# EAGLE design nRF_prog_vusb (EAGLE 6.4)
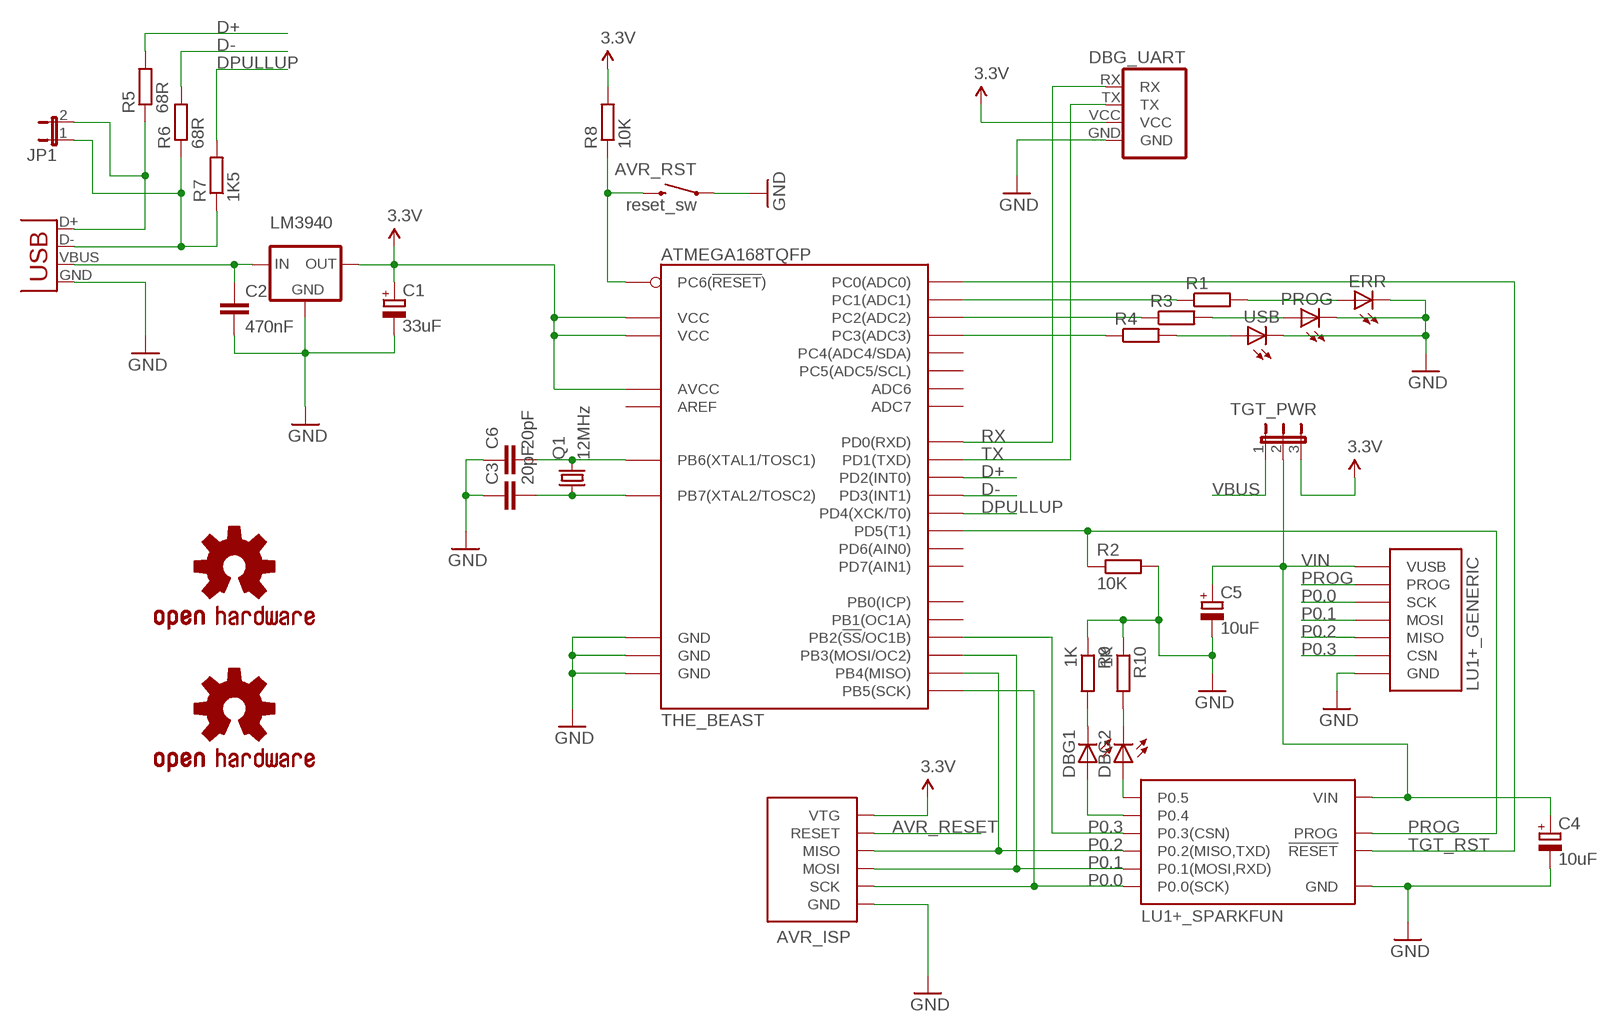
[diagram p0: schematic, sheet 1]

## Parts
AVR_ISP  AVR-ISP-6SMALL_FP  [AVR-ISP-6-SMALL-FP]
AVR_RST  reset_sw  SWITCH-MOMENTARY-2SMD  [TACTILE_SWITCH_SMD]
C1  33uF  CPOL-EUSMCB  [SMC_B]
C2  470nF  C-EUC0805K  [C0805K]
C3  20pF  C-EUC0805  [C0805]
C4  10uF  CPOL-EUSMCB  [SMC_B]
C5  10uF  CPOL-EUSMCB  [SMC_B]
C6  20pF  C-EUC0805  [C0805]
DBG1  LEDCHIPLED_0805  [CHIPLED_0805]
DBG2  LEDCHIPLED_0805  [CHIPLED_0805]
DBG_UART  UART_PORT  [UART_PORT]
ERR  LEDCHIPLED_0805  [CHIPLED_0805]
JP1  JP1E  [JP1]
LM3940  LM3940  [SOT223]
LU1+_GENERIC  NRF24LU1P_GENERIC  [NRF24LU1P_GENERIC]
LU1+_SPARKFUN  NRF24LU1P_SPARKFUN_BREAKOUT  [NRF24LU+_SPARKFUN_BREAKOUT]
PROG  LEDCHIPLED_0805  [CHIPLED_0805]
Q1  12MHz  CRYSTALHC49U-V  [QUARTZ]
R1  R-EU_M0805  [M0805]
R2  10K  R-EU_M0805  [M0805]
R3  R-EU_M0805  [M0805]
R4  R-EU_M0805  [M0805]
R5  68R  R-EU_M0805  [M0805]
R6  68R  R-EU_M0805  [M0805]
R7  1K5  R-EU_M0805  [M0805]
R8  10K  R-EU_M0805  [M0805]
R9  1K  R-EU_M0805  [M0805]
R10  1K  R-EU_M0805  [M0805]
TGT_PWR  JP2E  [JP2]
THE_BEAST  ATMEGA168TQFP  [TQFP32-08]
U$1  OSHW-LOGOM  [OSHW-LOGO-M]
U$2  OSHW-LOGOL  [OSHW-LOGO-L]
USB  LEDCHIPLED_0805  [CHIPLED_0805]
USB-B  USBPTH  [USB-B-PTH]

## Nets
3.3V: AVR_ISP.VCC(VTG) C1.+ DBG_UART.VCC LM3940.3(OUT) R8.2 TGT_PWR.3 THE_BEAST.4(VCC) THE_BEAST.6(VCC) THE_BEAST.18(AVCC)
AVR_RESET: AVR_ISP.RESET AVR_RST.3 R8.1 THE_BEAST.29(PC6(!RESET!))
D+: R5.2 THE_BEAST.32(PD2(INT0))
D-: R6.2 THE_BEAST.1(PD3(INT1))
DPULLUP: R7.2 THE_BEAST.2(PD4(XCK/T0))
GND: AVR_ISP.GND AVR_RST.1 C1.- C2.2 C3.1 C4.- C5.- C6.1 DBG_UART.GND ERR.C LM3940.2(GND) LM3940.4(GND) LU1+_GENERIC.GND LU1+_SPARKFUN.GND PROG.C R2.2 R9.1 R10.1 THE_BEAST.3(GND) THE_BEAST.5(GND) THE_BEAST.21(GND) USB-B.GND USB.C
N$1: DBG2.A LU1+_SPARKFUN.P0.5
N$2: DBG1.A LU1+_SPARKFUN.P0.4
N$3: DBG2.C R10.2
N$4: DBG1.C R9.2
N$8: R4.1 THE_BEAST.26(PC3(ADC3))
N$9: R3.1 THE_BEAST.25(PC2(ADC2))
N$13: R1.1 THE_BEAST.24(PC1(ADC1))
N$18: R4.2 USB.A
N$19: PROG.A R3.2
N$20: ERR.A R1.2
N$26: C6.2 Q1.2 THE_BEAST.7(PB6(XTAL1/TOSC1))
N$27: C3.2 Q1.1 THE_BEAST.8(PB7(XTAL2/TOSC2))
P0.0: AVR_ISP.SCK LU1+_GENERIC.SCK LU1+_SPARKFUN.P0.0(P0.0(SCK)) THE_BEAST.17(PB5(SCK))
P0.1: AVR_ISP.MOSI LU1+_GENERIC.MOSI LU1+_SPARKFUN.P0.1(P0.1(MOSI,RXD)) THE_BEAST.15(PB3(MOSI/OC2))
P0.2: AVR_ISP.MISO LU1+_GENERIC.MISO LU1+_SPARKFUN.P0.2(P0.2(MISO,TXD)) THE_BEAST.16(PB4(MISO))
P0.3: LU1+_GENERIC.CSN LU1+_SPARKFUN.P0.3(P0.3(CSN)) THE_BEAST.14(PB2(!SS!/OC1B))
PROG: LU1+_GENERIC.PROG LU1+_SPARKFUN.PROG R2.1 THE_BEAST.9(PD5(T1))
RX: DBG_UART.RX THE_BEAST.30(PD0(RXD))
TGT_RST: LU1+_SPARKFUN.RESET(!RESET!) THE_BEAST.23(PC0(ADC0))
TX: DBG_UART.TX THE_BEAST.31(PD1(TXD))
USB_D+: JP1.2 R5.1 USB-B.D+
USB_D-: JP1.1 R6.1 R7.1 USB-B.D-
VBUS: C2.1 LM3940.1(IN) TGT_PWR.1 USB-B.VBUS
VIN: C4.+ C5.+ LU1+_GENERIC.VUSB LU1+_SPARKFUN.VIN TGT_PWR.2
Unconnected: THE_BEAST.10(PD6(AIN0)) THE_BEAST.11(PD7(AIN1)) THE_BEAST.12(PB0(ICP)) THE_BEAST.13(PB1(OC1A)) THE_BEAST.19(ADC6) THE_BEAST.20(AREF) THE_BEAST.22(ADC7) THE_BEAST.27(PC4(ADC4/SDA)) THE_BEAST.28(PC5(ADC5/SCL))

## Library data of the parts
AVR_ISP = KileParts:AVR-ISP-6: AVR ISP-6 Serial Programming Header
AVR_RST = KileParts:SWITCH-MOMENTARY-2
C1 C4 C5 = rcl:CPOL-EU: POLARIZED CAPACITOR, European symbol
C2 C3 C6 = rcl:C-EU: CAPACITOR, European symbol
DBG1 DBG2 ERR PROG USB = led:LED: LED OSRAM: - CHIPLED LG R971, LG N971, LY N971, LG Q971, LY Q971, LO R971, LY R971 LH N974, LH R974 LS Q976, LO Q976, LY Q976 LO Q996 - Hyper CHIPLED LW Q18S LB Q993, LB Q99A, LB R99A - SideLED LS A670, LO A670, LY A670, LG A670, LP A670 LB A673, LV A673, LT A673, LW A673 LH A674 LY A675 LS A676, LA A676, LO A676, LY A676, LW A676 LS A679, LY A679, LG A679 - Hyper Micro SIDELED® LS Y876, LA Y876, LO Y876, LY Y876 LT Y87S - SmartLED LW L88C, LW L88S LB L89C, LB L89S, LG L890 LS L89K, LO L89K, LY L89K LS L896, LA L896, LO L896, LY L896 - TOPLED LS T670, LO T670, LY T670, LG T670, LP T670 LSG T670, LSP T670, LSY T670, LOP T670, LYG T670 LG T671, LOG T671, LSG T671 LB T673, LV T673, LT T673, LW T673 LH T674 LS T676, LA T676, LO T676, LY T676, LB T676, LH T676, LSB T676, LW T676 LB T67C, LV T67C, LT T67C, LS T67K, LO T67K, LY T67K, LW E67C LS E67B, LA E67B, LO E67B, LY E67B, LB E67C, LV E67C, LT E67C LW T67C LS T679, LY T679, LG T679 LS T770, LO T770, LY T770, LG T770, LP T770 LB T773, LV T773, LT T773, LW T773 LH T774 LS E675, LA E675, LY E675, LS T675 LS T776, LA T776, LO T776, LY T776, LB T776 LHGB T686 LT T68C, LB T68C - Hyper Mini TOPLED® LB M676 - Mini TOPLED Santana® LG M470 LS M47K, LO M47K, LY M47K Source: http://www.osram.convergy.de LUXEON: - LUMILED® LXK2-PW12-R00, LXK2-PW12-S00, LXK2-PW14-U00, LXK2-PW14-V00 LXK2-PM12-R00, LXK2-PM12-S00, LXK2-PM14-U00 LXK2-PE12-Q00, LXK2-PE12-R00, LXK2-PE12-S00, LXK2-PE14-T00, LXK2-PE14-U00 LXK2-PB12-K00, LXK2-PB12-L00, LXK2-PB12-M00, LXK2-PB14-N00, LXK2-PB14-P00, LXK2-PB14-Q00 LXK2-PR12-L00, LXK2-PR12-M00, LXK2-PR14-Q00, LXK2-PR14-R00 LXK2-PD12-Q00, LXK2-PD12-R00, LXK2-PD12-S00 LXK2-PH12-R00, LXK2-PH12-S00 LXK2-PL12-P00, LXK2-PL12-Q00, LXK2-PL12-R00 Source: www.luxeon.com KINGBRIGHT: KA-3528ASYC Source: www.kingbright.com
DBG_UART = KileParts:UART_PORT: PIN HEADER; OC_FARNELL: unknown; OC_NEWARK: unknown
JP1 = KileParts:JP1E: JUMPER
LM3940 = KileParts:LM3940: Low drop (max 0.4V at 500mA) 3.3V regulator - good for USB 5V to 3.3V
LU1+_GENERIC = KileParts:NRF24LU1P_GENERIC
LU1+_SPARKFUN = KileParts:NRF24LU1P_SPARKFUN_BREAKOUT
Q1 = KileParts:CRYSTAL: CRYSTAL; OC_FARNELL: 1666969; OC_NEWARK: unknown
R1-R10 = rcl:R-EU_: RESISTOR, European symbol
TGT_PWR = KileParts:JP2E: JUMPER
THE_BEAST = KileParts:ATMEGA168
U$1 U$2 = SparkFun:OSHW-LOGO: Open Source Hardware Logo This logo indicates the piece of hardware it is found on incorporates a OSHW license and/or adheres to the definition of open source hardware found here: http://freedomdefined.org/OSHW
USB-B = KileParts:USB: USB Connectors USB-B-PTH is fully proven SKU : PRT-00139 USB-miniB is fully proven SKU : PRT-00587 USB-A-PCB is untested. USB-A-H is throughly reviewed, but untested. Spark Fun Electronics SKU : PRT-00437 USB-B-SMT is throughly reviewed, but untested. Needs silkscreen touching up. USB-A-S has not been used/tested USB-MB-H has not been used/tested

## Board
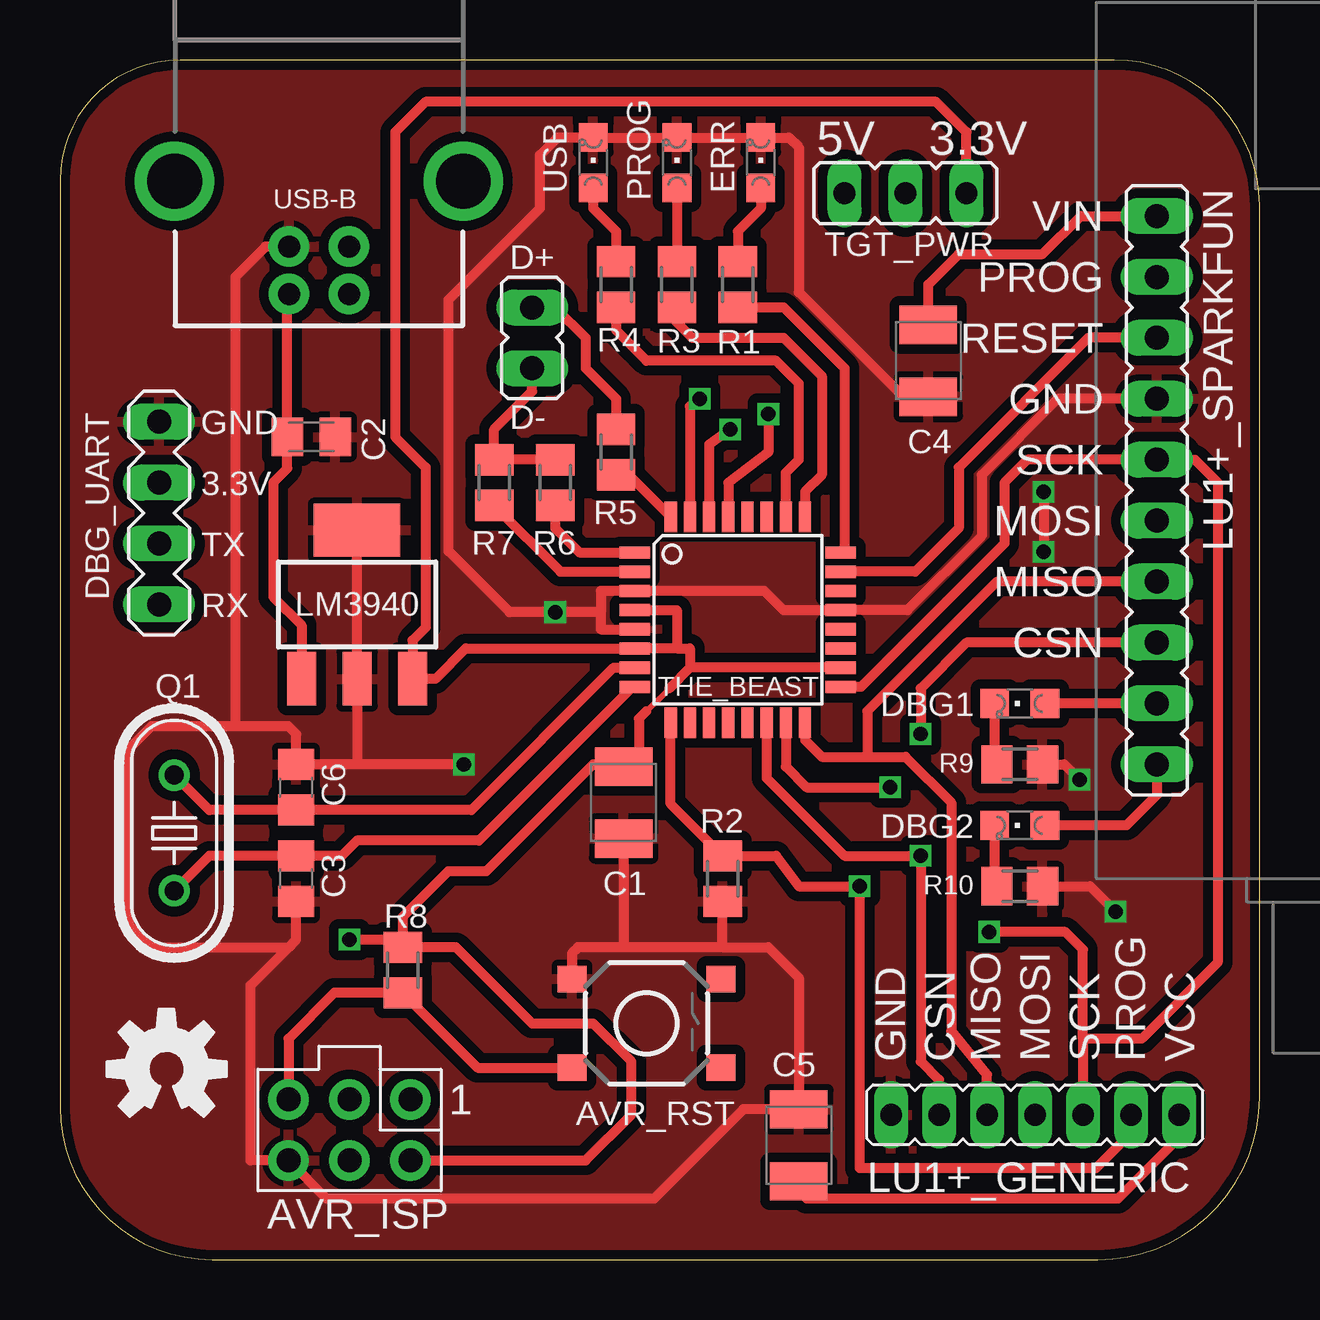
[diagram p1: board, top side]
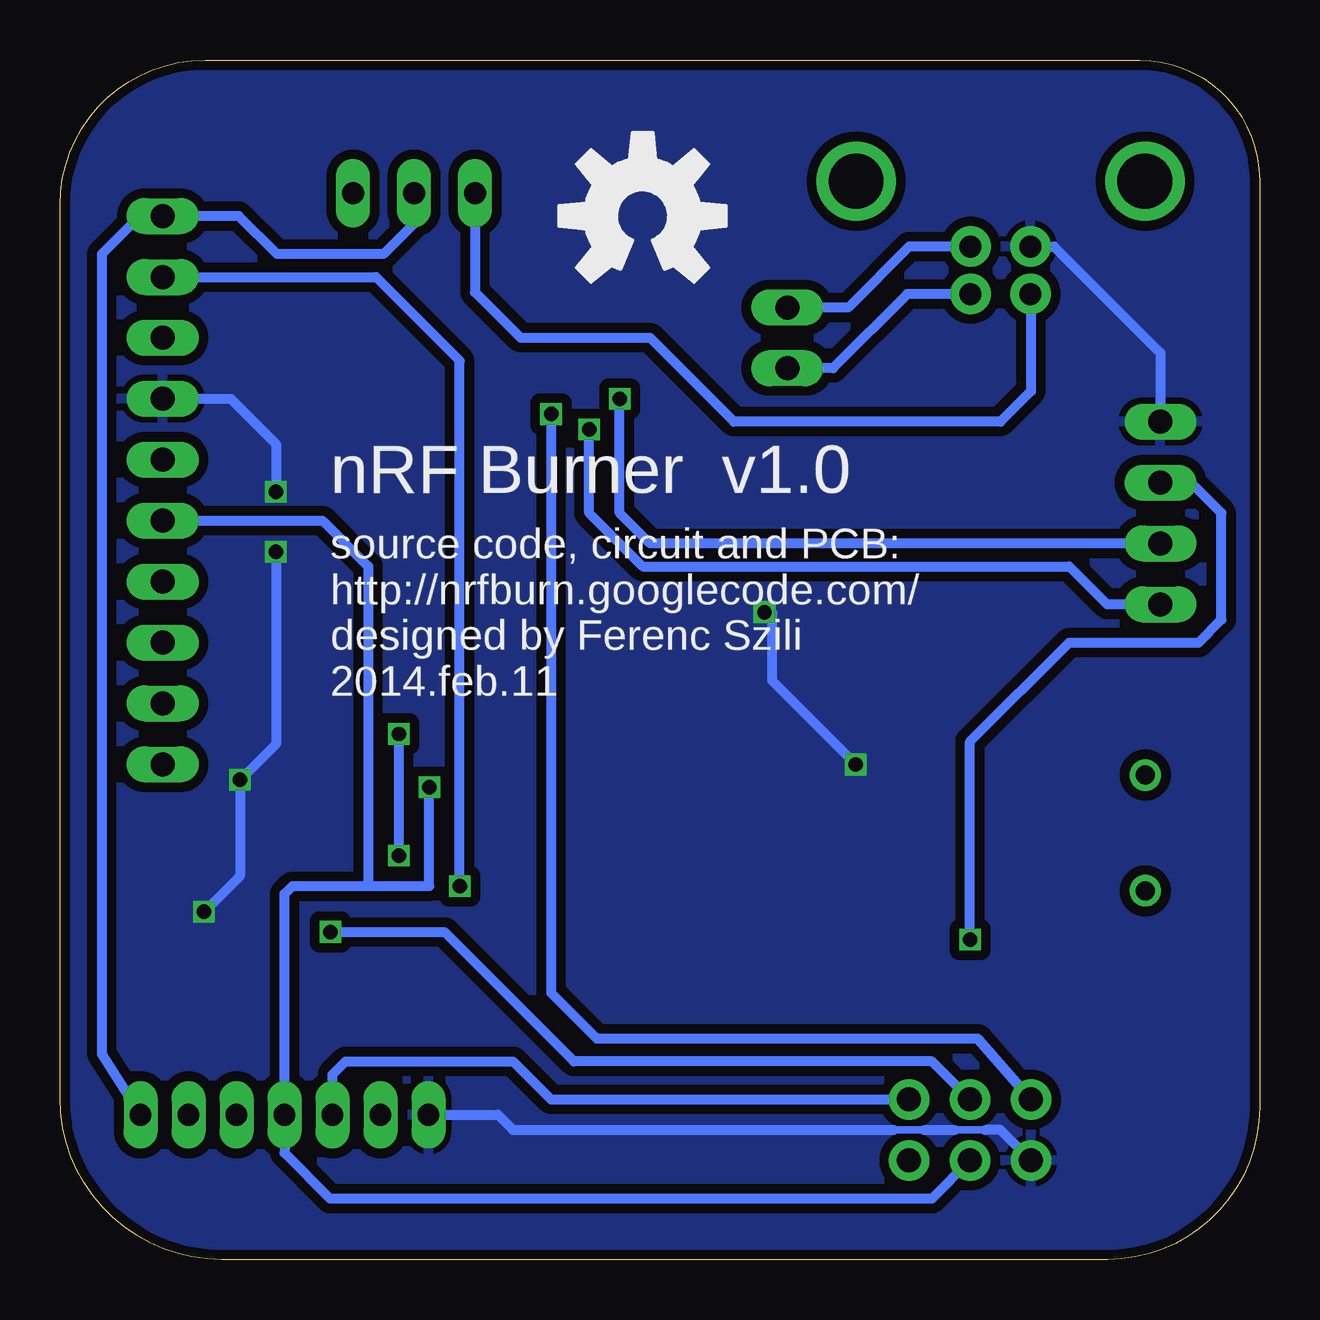
[diagram p2: board, bottom side, seen from below]

Size 50 x 50 mm. Coordinates in mm from the lower left corner, seen from the top.
Outline: 43.95,50 5,50 arc90 0,45 0,6.35 arc90 6.35,0 43.27,0 arc90 50,6.73 50,43.95 arc90 43.95,50
Copper layers (1*16): Top 0.035mm / dielectric 1.5mm / Bottom 0.035mm
Design rules "ITEADstudio_DRC": minimum track width 6mil, minimum drill 12mil, track to track 6mil, track to pad 6mil, pad to pad 6mil, via to via 6mil, smd to smd 0mil, copper to edge 10mil, drill to drill 10mil, minimum pad ring 10mil, minimum via ring 6mil, stop-mask expansion 2mil, vias tented up to drill 100mil, thermal gap 10mil

### Footprints (pad centres in the part's own frame; a part is rotated, then mirrored left to right if it is on the bottom)
AVR-ISP-6-SMALL-FP = drill 1 pad 1.676: GND 2.54,1.27; MISO -2.54,-1.27; MOSI 0,1.27; RESET 2.54,-1.27; SCK 0,-1.27; VCC -2.54,1.27
TACTILE_SWITCH_SMD = smd 1.2 x 1.1: 1 -3.1,1.85; 2 3.1,1.85; 3 -3.1,-1.85; 4 3.1,-1.85
SMC_B = smd 1.6 x 2.4: + -1.5,0; - 1.5,0
C0805K = smd 1.3 x 1.6: 1 -1,0; 2 1,0
C0805 = smd 1.3 x 1.5: 1 -0.95,0; 2 0.95,0
CHIPLED_0805 = smd 1.2 x 1.2: A 0,-1.05; C 0,1.05
UART_PORT = drill 1 long: GND 3.81,0; RX -3.81,0; TX -1.27,0; VCC 1.27,0
JP1 = drill 1 long: 1 0,-1.27; 2 0,1.27
SOT223 = smd 1.219 x 2.235: 1 -2.311,-3.099; 2 0,-3.099; 3 2.311,-3.099 | smd 3.6 x 2.2: 4 0,3.099
NRF24LU1P_GENERIC = drill 0.9 long: CSN 4,0; GND 6,0; MISO 2,0; MOSI 0,0; PROG -4,0; SCK -2,0; VUSB -6,0
NRF24LU+_SPARKFUN_BREAKOUT = drill 1 long: GND 0,-3.81; P0.0 0,-1.27; P0.1 0,1.27; P0.2 0,3.81; P0.3 0,6.35; P0.4 0,8.89; P0.5 0,11.43; PROG 0,-8.89; RESET 0,-6.35; VIN 0,-11.43
QUARTZ = drill 0.8: 1 -2.413,0; 2 2.413,0
M0805 = smd 1.3 x 1.6: 1 -0.95,0; 2 0.95,0
JP2 = drill 0.914 long: 1 -2.54,0; 2 0,0; 3 2.54,0
TQFP32-08 = smd 1.27 x 0.508: 1 -4.293,2.8; 2 -4.293,2; 3 -4.293,1.2; 4 -4.293,0.4; 5 -4.293,-0.4; 6 -4.293,-1.2; 7 -4.293,-2; 8 -4.293,-2.8; 17 4.293,-2.8; 18 4.293,-2; 19 4.293,-1.2; 20 4.293,-0.4; 21 4.293,0.4; 22 4.293,1.2; 23 4.293,2; 24 4.293,2.8 | smd 0.508 x 1.27: 9 -2.8,-4.293; 10 -2,-4.293; 11 -1.2,-4.293; 12 -0.4,-4.293; 13 0.4,-4.293; 14 1.2,-4.293; 15 2,-4.293; 16 2.8,-4.293; 25 2.8,4.293; 26 2,4.293; 27 1.2,4.293; 28 0.4,4.293; 29 -0.4,4.293; 30 -1.2,4.293; 31 -2,4.293; 32 -2.8,4.293
USB-B-PTH = drill 0.914 pad 1.676: D+ 0,1.25; D- 1.981,1.25; GND 0,-1.25; VBUS 1.981,-1.25 | drill 2.286: S1 -2.718,-6.02; S2 -2.718,6.02

### Placement (x,y rotation side)
AVR_ISP  12.06,5.4 180 top
AVR_RST  24.45,9.84 0 top
C1  23.5,19.05 270 top
C2  10.48,34.29 0 top
C3  9.84,15.88 90 top
C4  36.2,37.47 270 top
C5  30.8,4.76 90 top
C6  9.84,19.68 270 top
DBG1  40.01,23.18 90 top
DBG2  40.01,18.1 90 top
DBG_UART  4.13,31.11 90 top
ERR  29.21,45.72 0 top
JP1  19.68,38.42 0 top
LM3940  12.38,27.3 0 top
LU1+_GENERIC  40.64,6.03 180 top
LU1+_SPARKFUN  45.72,32.07 180 top
PROG  25.72,45.72 0 top
Q1  4.76,17.78 90 top
R1  28.26,40.64 90 top
R2  27.62,15.88 270 top
R3  25.72,40.64 90 top
R4  23.18,40.64 90 top
R5  23.18,33.66 270 top
R6  20.64,32.38 270 top
R7  18.1,32.38 270 top
R8  14.29,12.06 90 top
R9  40.01,20.64 180 top
R10  40.01,15.56 180 top
TGT_PWR  35.24,44.45 0 top
THE_BEAST  28.26,26.67 0 top
U$1  4.45,7.94 0 top
U$2  25.72,43.5 0 bottom
USB  22.23,45.72 0 top
USB-B  10.79,42.23 270 top

### Tracks (layer width: path | path; a pad name or v marks a point on that pad's centre or on a via)
3.3V  (via drill 0.6)
  Top 0.254: 25.4,23.81 24.45,22.86
  Top 0.406: THE_BEAST.4 25.72,27.07 25.72,25.47 | 25.72,25.47 THE_BEAST.6 16.92,25.47 15.65,24.21 LM3940.3 14.69,25.81 15.24,26.35 15.24,33.02 13.97,34.29 13.97,46.99 15.24,48.26 36.51,48.26 37.78,46.99 TGT_PWR.3 | R8.2 | 23.5,20.32 C1.+ 23.58,20.64 | THE_BEAST.18 26.26,24.67 | 25.72,25.47 26.26,25.47 26.26,24.67 | v12.06,13.34 13.97,13.34 R8.2 | 26.26,24.67 25.4,23.81 | 24.45,22.86 24.13,22.54 24.13,21.18 23.58,20.64 | R8.2 16.51,13.02 19.68,9.84 22.23,9.84 23.81,8.26 23.81,6.03 21.91,4.13 AVR_ISP.VCC | R8.2 14.29,14.29 16.19,16.19 17.78,16.19 22.23,20.64 23.58,20.64
  Bottom 0.406: DBG_UART.VCC 2.86,32.38 1.59,31.11 1.59,26.67 2.54,25.72 7.94,25.72 12.06,21.59 v12.06,13.34
AVR_RESET  (via drill 0.6)
  Top 0.406: v29.53,35.24 29.53,33.66 27.86,32.38 THE_BEAST.29 | AVR_RST.3 17.41,7.99 R8.1 11.43,11.12 9.53,9.21 AVR_ISP.RESET
  Bottom 0.406: AVR_ISP.RESET 11.75,9.21 27.62,9.21 29.53,11.11 v29.53,35.24
D+
  Top 0.406: R5.2 23.71,32.7 THE_BEAST.32
D-
  Top 0.406: R6.2 20.64,30.48 21.65,29.47 THE_BEAST.1
DPULLUP
  Top 0.406: R7.2 20.86,28.67 THE_BEAST.2
GND  (via drill 0.6)
  Top 0.406: 22.54,26.99 22.54,27.87 THE_BEAST.3 29.36,27.87 30.16,27.07 THE_BEAST.21 35.33,27.07 38.42,30.16 38.42,32.7 41.59,35.88 LU1+_SPARKFUN.GND 46.99,35.88 | THE_BEAST.5 22.54,26.27 22.54,26.99 | 27.62,13.02 23.5,13.02 | C1.- 23.5,13.02 | 9.53,13.02 7.94,11.43 7.94,4.13 AVR_ISP.GND 11.11,2.54 24.77,2.54 28.49,6.26 C5.- 30.8,11.75 29.53,13.02 27.62,13.02 | 9.53,13.02 9.84,13.34 C3.1 | 22.54,26.99 v20.64,26.99 18.73,26.99 16.19,29.53 16.19,40.01 20,43.81 20,46.04 20.73,46.77 USB.C PROG.C ERR.C 30.38,46.77 30.8,46.35 30.8,40.32 35.16,35.97 C4.- 36.11,35.88 | 27.62,13.02 R2.2 | R10.1 42.94,15.56 v44,14.5 | v41,32 v41,29.5 | R9.1 41.86,20.64 v42.5,20 | USB-B.GND 8.57,42.23 7.3,40.96 7.3,22.23 | v16.83,20.64 12.38,20.64 | 12.38,20.64 C6.1 | C6.1 | 7.3,22.23 3.81,22.23 2.86,21.27 2.86,13.97 3.81,13.02 9.53,13.02 | LM3940.4 LM3940.2 12.38,20.64 | C6.1 9.85,21.91 9.53,22.23 7.3,22.23 | 23.5,13.02 21.59,13.02 21.35,12.78 AVR_RST.1
  Bottom 0.305: 15.24,5.4 13.97,5.4 | 12.7,5.4 11.43,5.4
  Bottom 0.406: LU1+_GENERIC.GND 31.75,6.03 31.11,5.4 15.24,5.4 | AVR_ISP.GND 10.79,5.4 11.43,5.4 | 13.97,5.4 12.7,5.4 | v20.64,26.99 20.32,26.99 20.32,24.13 v16.83,20.64 | LU1+_SPARKFUN.GND 42.88,35.88 41,34 v41,32 | v41,29.5 41,21.5 v42.5,20 42.5,16 v44,14.5 | USB-B.GND 8.57,42.23 4.13,37.78 DBG_UART.GND
  pour Bottom (isolate 0.406): 50,43.92 50,6.71 arc-90 43.29,0 6.32,0 arc-90 0,6.32 0,45 arc-90 5,50 43.92,50 arc-90
  pour Top (isolate 0.406): 50,43.92 50,6.71 arc-90 43.29,0 6.32,0 arc-90 0,6.32 0,45 arc-90 5,50 43.92,50 arc-90
N$1
  Top 0.406: LU1+_SPARKFUN.P0.5 45.72,19.37 44.45,18.1 DBG2.A
N$2
  Top 0.406: LU1+_SPARKFUN.P0.4 DBG1.A
N$3
  Top 0.406: DBG2.C 38.95,15.66 R10.2
N$4
  Top 0.406: DBG1.C 38.95,20.74 R9.2
N$8
  Top 0.406: THE_BEAST.26 30.26,32.8 30.8,33.34 30.8,36.51 29.84,37.47 24.45,37.47 23.18,38.73 R4.1
N$9
  Top 0.406: R3.1 25.72,39.05 26.35,38.42 30.16,38.42 31.75,36.83 31.75,32.7 31.06,32.01 THE_BEAST.25
N$13
  Top 0.406: R1.1 30.16,39.69 32.7,37.15 32.7,29.62 THE_BEAST.24
N$18
  Top 0.406: USB.A 22.23,43.81 23.18,42.86 R4.2
N$19
  Top 0.406: PROG.A R3.2
N$20
  Top 0.406: ERR.A 29.21,43.81 28.26,42.86 R1.2
N$26
  Top 0.406: C6.2 | THE_BEAST.7 23.08,24.67 17.15,18.73 C6.2 | C6.2 6.22,18.73 Q1.2
N$27
  Top 0.406: THE_BEAST.8 23.87,23.87 17.46,17.46 12.38,17.46 11.75,16.82 C3.2 6.22,16.82 Q1.1
P0.0  (via drill 0.6)
  Top 0.406: 42.64,9.21 LU1+_GENERIC.SCK | THE_BEAST.17 33.4,23.87 39.37,29.84 39.37,32.38 40.32,33.34 LU1+_SPARKFUN.P0.0 47.31,33.34 48.26,32.38 48.26,12.38 45.09,9.21 42.64,9.21 | 42.64,9.21 42.64,12.92 41.91,13.65 v38.73,13.65
  Bottom 0.406: AVR_ISP.SCK 13.65,8.26 28.57,8.26 33.97,13.65 v38.73,13.65
P0.1  (via drill 0.6)
  Top 0.406: THE_BEAST.15 30.26,20.54 31.11,19.68 v34.61,19.68
  Bottom 0.406: v34.61,19.68 34.61,15.56 37.15,15.56 | AVR_ISP.MOSI 13.65,2.54 38.73,2.54 40.64,4.45 LU1+_GENERIC.MOSI 40.64,15.24 40.32,15.56 37.15,15.56 | LU1+_SPARKFUN.P0.1 39.05,30.8 37.15,28.89 37.15,15.56
P0.2
  Top 0.406: LU1+_GENERIC.MISO 38.64,7.71 37.15,9.53 37.15,19.05 35.24,20.95 33.66,20.95 | THE_BEAST.16 31.06,21.65 31.75,20.95 33.66,20.95 | LU1+_SPARKFUN.P0.2 39.05,28.26 33.66,22.86 33.66,20.95
  Bottom 0.406: AVR_ISP.MISO 29.53,6.67 31.11,8.26 38.1,8.26 38.64,7.71 LU1+_GENERIC.MISO
P0.3  (via drill 0.6)
  Top 0.406: THE_BEAST.14 29.46,20.07 32.7,16.83 v35.88,16.83 35.88,8.26 36.64,7.49 LU1+_GENERIC.CSN | LU1+_SPARKFUN.P0.3 37.78,25.72 35.88,23.81 v35.88,21.91
  Bottom 0.406: v35.88,21.91 v35.88,16.83
PROG  (via drill 0.6)
  Top 0.406: LU1+_GENERIC.PROG 44.64,5.27 43.18,3.81 33.34,3.81 v33.34,15.56 30.8,15.56 29.85,16.82 R2.1 25.46,18.99 THE_BEAST.9
  Bottom 0.406: LU1+_SPARKFUN.PROG 36.83,40.96 33.34,37.47 v33.34,15.56
RX  (via drill 0.6)
  Top 0.406: v27.94,34.61 27.06,33.97 THE_BEAST.30
  Bottom 0.406: DBG_UART.RX 6.35,27.3 7.94,28.89 25.72,28.89 27.94,31.11 v27.94,34.61
TGT_RST
  Top 0.406: LU1+_SPARKFUN.RESET 42.86,38.42 37.47,33.02 37.47,30.48 35.66,28.67 THE_BEAST.23
TX  (via drill 0.6)
  Top 0.406: v26.67,35.88 26.26,35.56 THE_BEAST.31
  Bottom 0.406: DBG_UART.TX 25.4,29.84 26.67,31.11 v26.67,35.88
USB_D+
  Top 0.406: JP1.2 20.64,39.69 21.91,38.42 21.91,37.15 23.18,35.88 R5.1
  Bottom 0.406: USB-B.D+ 14.61,42.23 17.14,39.69 JP1.2
USB_D-
  Top 0.406: R6.1 R7.1 18.1,34.61 19.68,36.2 JP1.1
  Bottom 0.406: USB-B.D- 14.68,40.25 17.78,37.15 JP1.1
VBUS
  Top 0.406: 10.07,24.54 LM3940.1 10.07,26.44 8.89,27.62 8.89,32.38 9.48,32.97 C2.1 9.48,40.18 USB-B.VBUS
  Bottom 0.406: TGT_PWR.1 32.7,40.32 30.8,38.42 25.4,38.42 21.91,34.92 10.79,34.92 9.53,36.2 9.53,40.23 USB-B.VBUS
VIN
  Top 0.406: C5.+ 31.11,3.26 31.11,2.54 44.1,2.54 46.64,5.08 LU1+_GENERIC.VUSB | LU1+_SPARKFUN.VIN 42.55,43.5 40.96,41.91 37.47,41.91 36.2,40.64 C4.+
  Bottom 0.406: LU1+_GENERIC.VUSB 48.26,8.57 48.26,41.91 46.67,43.5 LU1+_SPARKFUN.VIN 42.55,43.5 40.96,41.91 36.51,41.91 35.24,43.18 TGT_PWR.2

### Text on the board
tNames: 5V | 3.3V | VIN | D+ | PROG | RESET | D- | GND | SCK | MOSI | MISO | CSN | GND | CSN | MISO | MOSI | SCK | PROG | VCC
bNames: nRF Burner v1.0 | source code, circuit and PCB: / http://nrfburn.googlecode.com/ / designed by Ferenc Szili / 2014.feb.11